# Altium schematic sheet connect.SchDoc
size A4; SheetNumber: 1; SheetTotal: 5
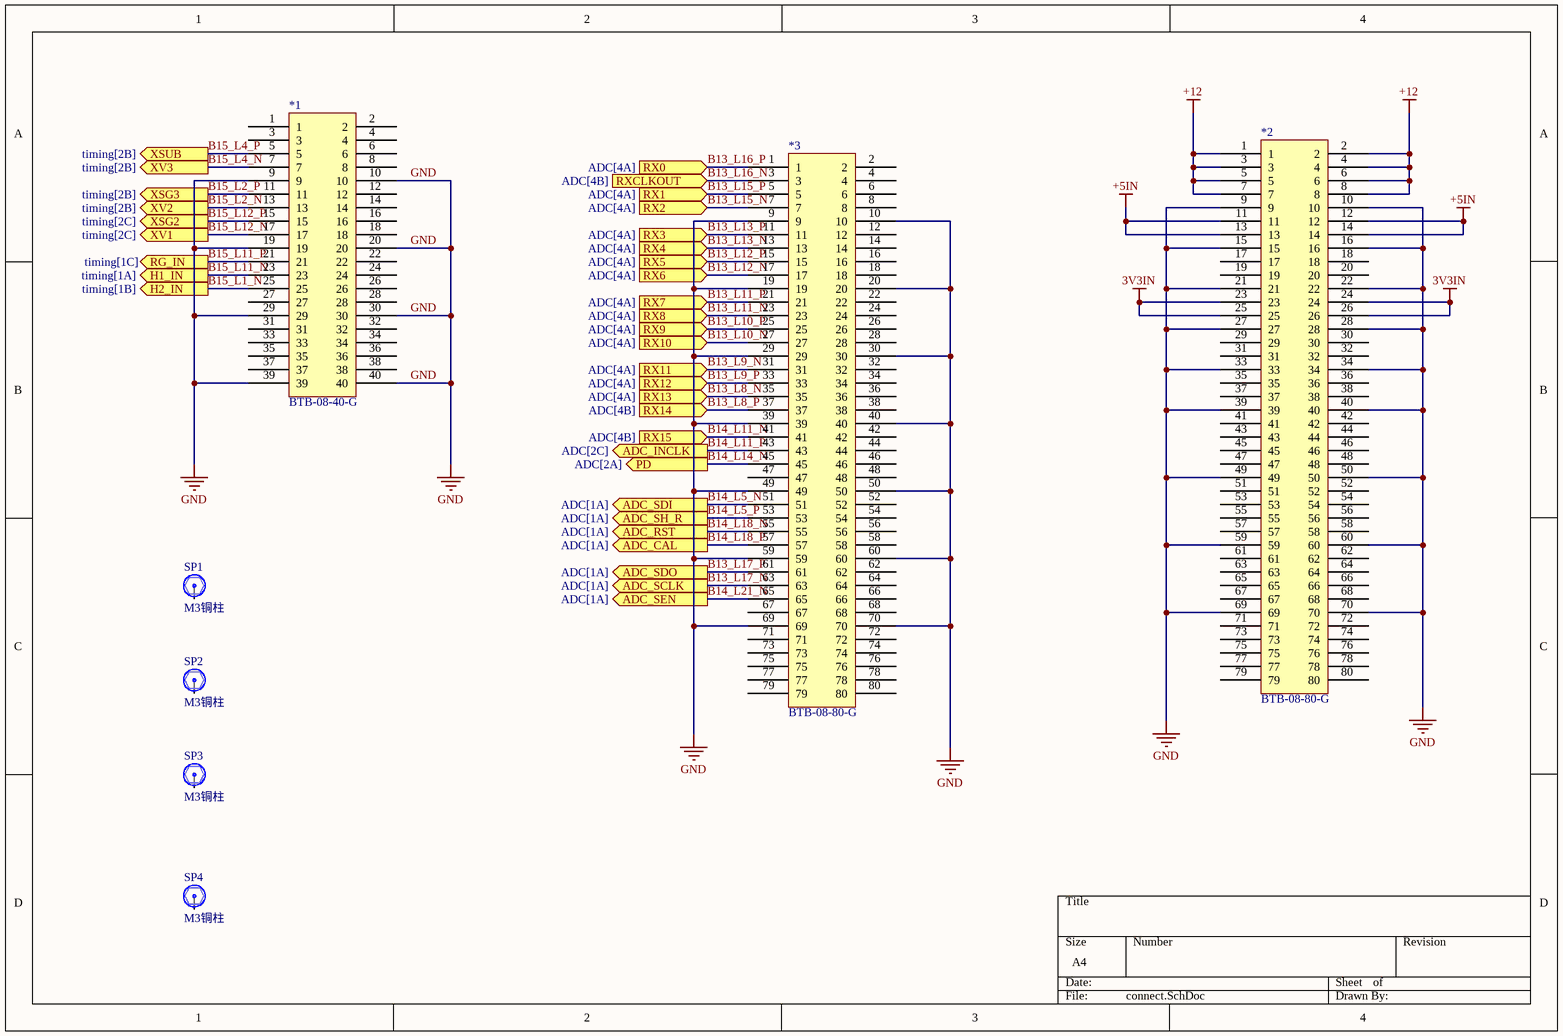
[diagram p0: connect.SchDoc]

## Parts
*1  BTB-08-40-G  [BTB-08-40-M]
*2  BTB-08-80-G  [BTB-08-80-G]
*3  BTB-08-80-G  [BTB-08-80-G]
SP1  M3铜柱  [M3x5_N]
SP2  M3铜柱  [M3x5_N]
SP3  M3铜柱  [M3x5_N]
SP4  M3铜柱  [M3x5_N]

## Ports
ADC_CAL (out, see ADC[1A]), ADC_INCLK (out, see ADC[2C]), ADC_RST (out, see ADC[1A]), ADC_SCLK (out, see ADC[1A]), ADC_SDI (out, see ADC[1A]), ADC_SDO (out, see ADC[1A]), ADC_SEN (out, see ADC[1A]), ADC_SH_R (out, see ADC[1A]), H1_IN (out, see timing[1A]), H2_IN (out, see timing[1B]), PD (out, see ADC[2A]), RG_IN (out, see timing[1C]), RX0 (in, see ADC[4A]), RX1 (in, see ADC[4A]), RX2 (in, see ADC[4A]), RX3 (in, see ADC[4A]), RX4 (in, see ADC[4A]), RX5 (in, see ADC[4A]), RX6 (in, see ADC[4A]), RX7 (in, see ADC[4A]), RX8 (in, see ADC[4A]), RX9 (in, see ADC[4A]), RX10 (in, see ADC[4A]), RX11 (in, see ADC[4A]), RX12 (in, see ADC[4A]), RX13 (in, see ADC[4A]), RX14 (in, see ADC[4B]), RX15 (in, see ADC[4B]), RXCLKOUT (in, see ADC[4B]), XSG2 (out, see timing[2C]), XSG3 (out, see timing[2B]), XSUB (out, see timing[2B]), XV1 (out, see timing[2C]), XV2 (out, see timing[2B]), XV3 (out, see timing[2B])

## Nets
3V3IN: *2.23 *2.24 *2.25 *2.26
+5IN: *2.11 *2.12 *2.13 *2.14
+12: *2.1 *2.2 *2.3 *2.4 *2.5 *2.6 *2.7 *2.8
GND: *1.9 *1.10 *1.19 *1.20 *1.29 *1.30 *1.39 *1.40 *2.9 *2.10 *2.15 *2.16 *2.21 *2.22 *2.27 *2.28 *2.33 *2.34 *2.39 *2.40 *2.49 *2.50 *2.59 *2.60 *2.69 *2.70 *3.9 *3.10 *3.19 *3.20 *3.29 *3.30 *3.39 *3.40 *3.49 *3.50 *3.59 *3.60 *3.69 *3.70
B13_L8_N: *3.35 ; port RX13
B13_L8_P: *3.37 ; port RX14
B13_L9_N: *3.31 ; port RX11
B13_L9_P: *3.33 ; port RX12
B13_L10_N: *3.27 ; port RX10
B13_L10_P: *3.25 ; port RX9
B13_L11_N: *3.23 ; port RX8
B13_L11_P: *3.21 ; port RX7
B13_L12_N: *3.17 ; port RX6
B13_L12_P: *3.15 ; port RX5
B13_L13_N: *3.13 ; port RX4
B13_L13_P: *3.11 ; port RX3
B13_L15_N: *3.7 ; port RX2
B13_L15_P: *3.5 ; port RX1
B13_L16_N: *3.3 ; port RXCLKOUT
B13_L16_P: *3.1 ; port RX0
B13_L17_N: *3.63 ; port ADC_SCLK
B13_L17_P: *3.61 ; port ADC_SDO
B14_L5_N: *3.51 ; port ADC_SDI
B14_L5_P: *3.53 ; port ADC_SH_R
B14_L11_N: *3.41 ; port RX15
B14_L11_P: *3.43 ; port ADC_INCLK
B14_L14_N: *3.45 ; port PD
B14_L18_N: *3.55 ; port ADC_RST
B14_L18_P: *3.57 ; port ADC_CAL
B14_L21_N: *3.65 ; port ADC_SEN
B15_L1_N: *1.25 ; port H2_IN
B15_L2_N: *1.13 ; port XV2
B15_L2_P: *1.11 ; port XSG3
B15_L4_N: *1.7 ; port XV3
B15_L4_P: *1.5 ; port XSUB
B15_L11_N: *1.23 ; port H1_IN
B15_L11_P: *1.21 ; port RG_IN
B15_L12_N: *1.17 ; port XV1
B15_L12_P: *1.15 ; port XSG2

Not connected (* = marked no-connect by the designer): *1 1 2 3 4 6 8 12 14 16 18 22 24 26 27 28 31 32 33 34 35 36 37 38; *2 17 18 19 20 29 30 31 32 35 36 37 38 41 42 43 44 45 46 47 48 51 52 53 54 55 56 57 58 61 62 63 64 65 66 67 68 71 72 73 74 75 76 77 78 79 80; *3 2 4 6 8 12 14 16 18 22 24 26 28 32 34 36 38 42 44 46 47 48 52 54 56 58 62 64 66 67 68 71 72 73 74 75 76 77 78 79 80; SP1 1; SP2 1; SP3 1; SP4 1

## Library data of the parts
SP1-SP4 = 铜柱大焊盘: 铜柱; 版权归属: 封装库来自淘宝 ID：黄晶宝石; BOM名称: 铜柱; 学习资源: https://shop463601444.taobao.com